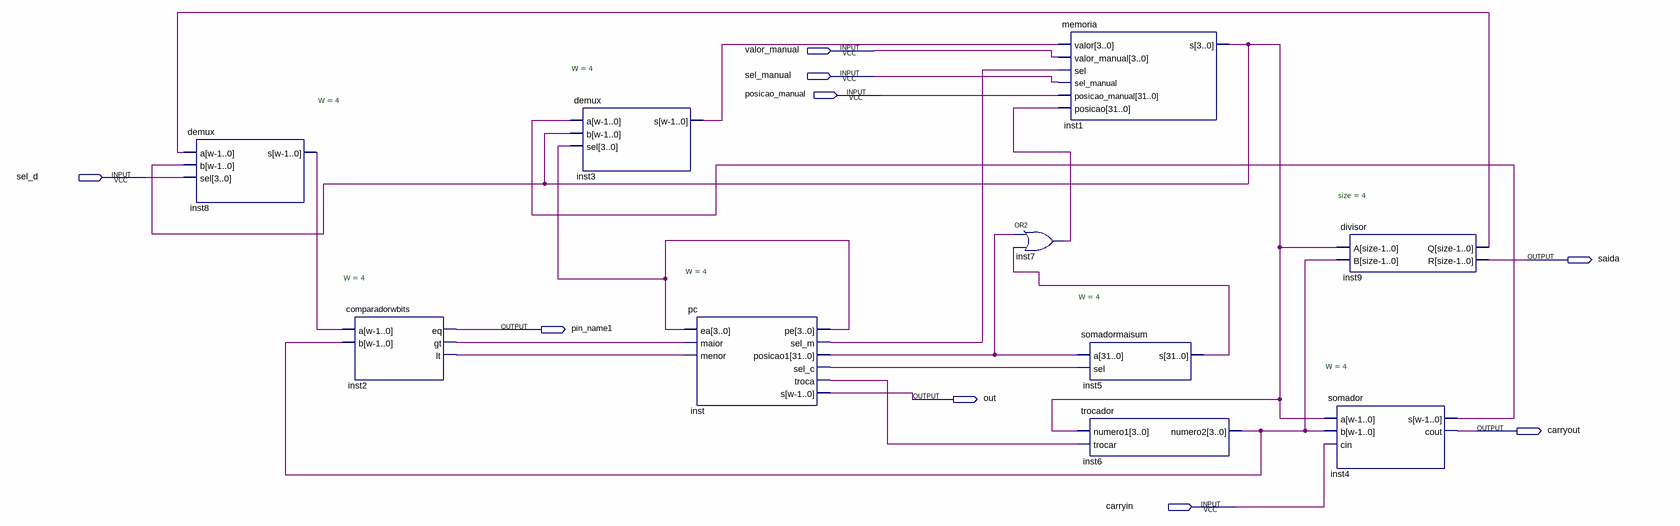
[diagram p0: schematic sheet]
// Quartus schematic trabalho3blocos.bdf as structural Verilog: 10 symbols, 9 pins
module trabalho3blocos (
  input  valor_manual,
  input  sel_manual,
  input  posicao_manual,
  input  sel_d,
  input  carryin,
  output saida,
  output pin_name1,
  output out,
  output carryout
);

  wire inst1_s, inst2_gt, inst2_lt, inst3_s, inst4_s, inst5_s, inst6_numero2, inst7_out, inst8_s, inst9_q,
       inst_posicao1, inst_sel_c, inst_sel_m, inst_troca;
  wire [3:0] inst_pe;

  demux #(.W(4)) inst8 (.a({4{inst9_q}}), .b({4{inst1_s}}), .sel({4{sel_d}}), .s(inst8_s));
  comparadorwbits #(.W(4)) inst2 (
    .a({4{inst8_s}}), .b({4{inst6_numero2}}), .eq(pin_name1), .gt(inst2_gt), .lt(inst2_lt));
  demux #(.W(4)) inst3 (.a({4{inst4_s}}), .b({4{inst1_s}}), .sel(inst_pe), .s(inst3_s));
  pc #(.W(4)) inst (
    .ea(inst_pe), .maior(inst2_gt), .menor(inst2_lt), .pe(inst_pe), .sel_m(inst_sel_m),
    .posicao1(inst_posicao1), .sel_c(inst_sel_c), .troca(inst_troca), .s(out));
  memoria inst1 (
    .valor({4{inst3_s}}), .valor_manual({4{valor_manual}}), .sel(inst_sel_m), .sel_manual(sel_manual),
    .posicao_manual({32{posicao_manual}}), .posicao({32{inst7_out}}), .s(inst1_s));
  or inst7 (inst7_out, inst_posicao1, inst5_s);
  somadormaisum #(.W(4)) inst5 (.a({32{inst_posicao1}}), .sel(inst_sel_c), .s(inst5_s));
  trocador inst6 (.numero1({4{inst1_s}}), .trocar(inst_troca), .numero2(inst6_numero2));
  divisor #(.size(4)) inst9 (.A({4{inst1_s}}), .B({4{inst6_numero2}}), .Q(inst9_q), .R(saida));
  somador #(.W(4)) inst4 (.a({4{inst1_s}}), .b({4{inst6_numero2}}), .cin(carryin), .s(inst4_s), .cout(carryout));
endmodule
